# Altium schematic sheet kijek.SchDoc: 3D CANDLE - rączka
size A2; Address1: Jacek Martyniak; Address2: Łukasz Nowarkiewicz; DocumentNumber: 2017-01; Revision: 1.0; SheetNumber: 1; SheetTotal: 1; PageSetup: Record=PageOptionsŽCenterHorizontal=FalseŽCenterVertical=FalseŽPrintScale=0.62ŽXCorrection=1.00ŽYCorrection=1.00ŽPrintKind=0ŽBorderSize=5000000ŽLeftOffset=0ŽBottomOffset=0ŽOrientation=2ŽPaperLength=1000ŽPaperWidth=1000ŽScale=100ŽPaperSource=7ŽPrintQuality=-4ŽMediaType=1ŽDitherType=10ŽPaperKind=A4ŽPrintScaleMode=0
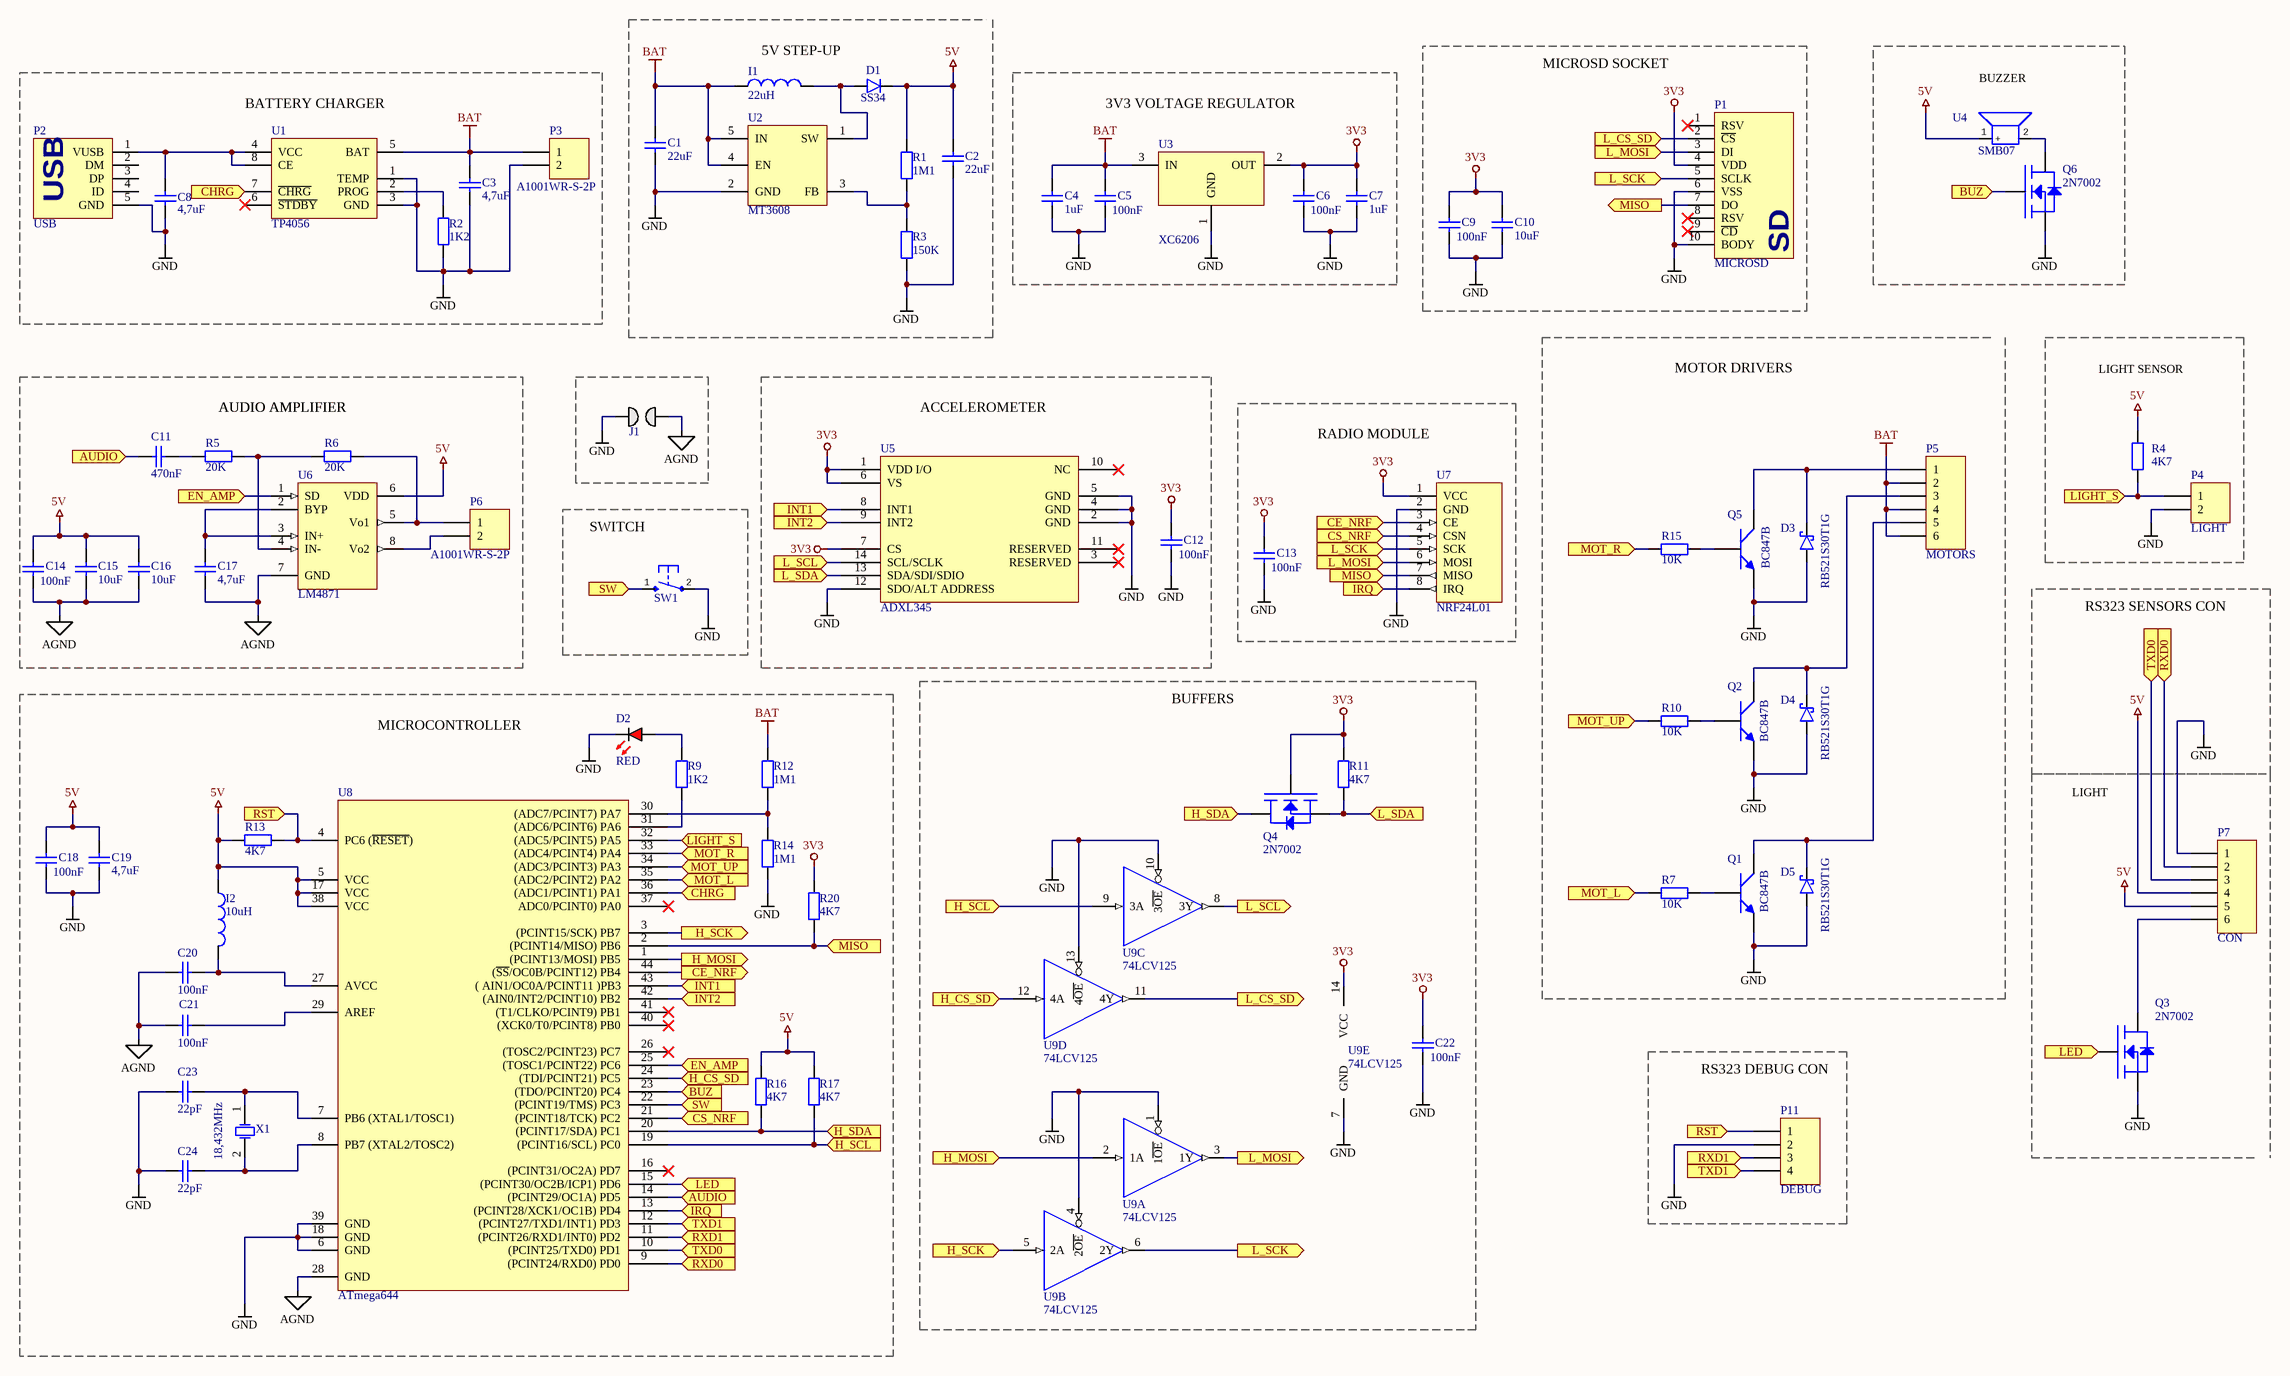
[diagram p0: kijek.SchDoc]

## Parts
C1  22uF  [C0603]
C2  22uF  [C0603]
C3  4,7uF  [C0603]
C4  1uF  [C0402]
C5  100nF  [C0402]
C6  100nF  [C0402]
C7  1uF  [C0402]
C8  4,7uF  [C0603]
C9  100nF  [C0402]
C10  10uF  [C0603]
C11  470nF  [C0402]
C12  100nF  [C0402]
C13  100nF  [C0402]
C14  100nF  [C0402]
C15  10uF  [C0603]
C16  10uF  [C0603]
C17  4,7uF  [C0603]
C18  100nF  [C0402]
C19  4,7uF  [C0603]
C20  100nF  [C0402]
C21  100nF  [C0402]
C22  100nF  [C0402]
C23  22pF  [C0402]
C24  22pF  [C0402]
D1  SS34  [SMA]
D2  RED  [LED0603]
D3  RB521S30T1G  [SOD523]
D4  RB521S30T1G  [SOD523]
D5  RB521S30T1G  [SOD523]
I1  22uH  [6x6x2.8mm]
I2  10uH  [I0603]
J1  SOLDER_JUMPER  [SOLDER_JUMPER]  (value not drawn)
P1  MICROSD  [MICROSD]
P2  USB  [MICRO_USB_2]
P3  A1001WR-S-2P  [A1001WR-S-2P]
P4  LIGHT  [A1001WR-S-2P]
P5  MOTORS  [A1001WR-S-6P]
P6  A1001WR-S-2P  [A1001WR-S-2P]
P7  CON  [MX-502352-0600]
P11  DEBUG  [PAD_4-1]
Q1  BC847B  [SOT23]
Q2  BC847B  [SOT23]
Q3  2N7002  [SOT23]
Q4  2N7002  [SOT23]
Q5  BC847B  [SOT23]
Q6  2N7002  [SOT23]
R1  1M1  [R0402]
R2  1K2  [R0402]
R3  150K  [R0402]
R4  4K7  [R0402]
R5  20K  [R0402]
R6  20K  [R0402]
R7  10K  [R0402]
R9  1K2  [R0402]
R10  10K  [R0402]
R11  4K7  [R0402]
R12  1M1  [R0402]
R13  4K7  [R0402]
R14  1M1  [R0402]
R15  10K  [R0402]
R16  4K7  [R0402]
R17  4K7  [R0402]
R20  4K7  [R0402]
SW1  SW_3x6x3.5mm  [3x6x3.5mm]  (value not drawn)
U1  TP4056  [SO-8]
U2  MT3608  [SOT-23-6]
U3  XC6206  [SOT23]
U4  SMB07  [SMB07]
U5  ADXL345  [LGA_CC-14]
U6  LM4871  [SO-8]
U7  NRF24L01  [NRF24L01]
U8  ATmega644  [TQFP-44A]
U9  74LCV125  [TSSOP-14]  (parts A,B,C,D,E of 5)
X1  18,432MHz  [CFPX-104]

## Blocks framed on the sheet
BATTERY CHARGER: C3 C8 P2 P3 R2 U1
3V3 VOLTAGE REGULATOR: C4-C7 U3
MICROSD SOCKET: C9 C10 P1
BUZZER: Q6 U4
ACCELEROMETER: C12 U5
LIGHT SENSOR: P4 R4
RADIO MODULE: C13 U7
SWITCH: SW1
MICROCONTROLLER: C18-C21 C23 C24 D2 I2 R9 R12-R14 R16 R17 R20 U8 X1
BUFFERS: C22 Q4 R11 U9
RS323 DEBUG CON: P11

## Ports
AUDIO, BUZ, CE_NRF, CE_NRF (out), CHRG, CS_NRF, EN_AMP, H_CS_SD, H_MOSI, H_MOSI (out), H_SCK, H_SCK (out), H_SCL, H_SDA, INT1, INT2, IRQ, L_CS_SD, L_CS_SD (out), L_MOSI, L_MOSI (out), L_SCK, L_SCK (out), L_SCL, L_SCL (out), L_SDA, LED, LIGHT_S, MISO, MISO (out), MOT_L, MOT_R, MOT_UP, RST, RXD0, RXD1, SW, TXD0, TXD1

## Nets
3V3: C6.1 C7.1 C9.1 C10.1 C12.1 C13.1 C22.1 P1.4(VDD) Q4.1(G) R11.1 R20.1 U3.2(OUT) U5.1(VDD_I/O) U5.6(VS) U5.7(CS) U7.1(VCC) U9.14(VCC)
5V: C2.1 C14.1 C15.1 C16.1 C18.1 C19.1 D1.1 I2.1 P7.4 P7.5 R1.1 R4.2 R13.1 R16.1 R17.1 U4.1(+) U6.6(VDD) U8.5(VCC) U8.17(VCC) U8.38(VCC)
AGND: C14.2 C15.2 C16.2 C17.2 C20.1 C21.2 J1.2 U6.7(GND) U8.28(GND)
BAT: C1.1 C3.1 C4.1 C5.1 I1.1 P3.1 P5.2 P5.4 P5.6 R12.2 U1.5(BAT) U2.4(EN) U2.5(IN) U3.3(IN)
GND: C1.2 C2.2 C3.2 C4.2 C5.2 C6.2 C7.2 C8.2 C9.2 C10.2 C12.2 C13.2 C18.2 C19.2 C22.2 C23.1 C24.2 D2.1 D3.2 D4.2 D5.2 J1.1 P1.6(VSS) P1.10(BODY) P2.5(GND) P3.2 P4.2 P7.1 P11.2 Q1.2(E) Q2.2(E) Q3.2(S) Q5.2(E) Q6.2(S) R2.1 R3.2 R14.2 SW1.2(P) U1.1(TEMP) U1.3(GND) U2.2(GND) U3.1(GND) U5.2(GND) U5.4(GND) U5.5(GND) U5.12(SDO/ALT_ADDRESS) U7.2(GND) U8.6(GND) U8.18(GND) U8.39(GND) U9.1(1~{OE}) U9.4(2~{OE}) U9.7(GND) U9.10(3~{OE}) U9.13(4~{OE})
AUDIO: C11.1 U8.14((PCINT29/OC1A)_PD5) ; port AUDIO
BUZ: Q6.1(G) U8.23((TDO/PCINT20)_PC4) ; port BUZ
CE_NRF: U7.3(CE) U8.44((~{SS}/OC0B/PCINT12)_PB4) ; port CE_NRF
CHRG: U1.7(~{CHRG}) U8.36((ADC1/PCINT1)_PA1) ; port CHRG
CS_NRF: U7.4(CSN) U8.21((PCINT18/TCK)_PC2) ; port CS_NRF
EN_AMP: U6.1(SD) U8.25((TOSC1/PCINT22)_PC6) ; port EN_AMP
H_CS_SD: U8.24((TDI/PCINT21)_PC5) U9.12(4A) ; port H_CS_SD
H_MOSI: U8.1((PCINT13/MOSI)_PB5) U9.2(1A) ; port H_MOSI
H_SCK: U8.3((PCINT15/SCK)_PB7) U9.5(2A) ; port H_SCK
H_SCL: R17.2 U8.19((PCINT16/SCL)_PC0) U9.9(3A) ; port H_SCL
H_SDA: Q4.3(D) R16.2 U8.20((PCINT17/SDA)_PC1) ; port H_SDA
INT1: U5.8(INT1) U8.43((_AIN1/OC0A/PCINT11_)PB3) ; port INT1
INT2: U5.9(INT2) U8.42((AIN0/INT2/PCINT10)_PB2) ; port INT2
IRQ: U7.8(IRQ) U8.13((PCINT28/XCK1/OC1B)_PD4) ; port IRQ
L_CS_SD: P1.2(~{CS}) U9.11(4Y) ; port L_CS_SD
L_MOSI: P1.3(DI) U7.6(MOSI) U9.3(1Y) ; port L_MOSI
L_SCK: P1.5(SCLK) U7.5(SCK) U9.6(2Y) ; port L_SCK
L_SCL: U5.14(SCL/SCLK) U9.8(3Y) ; port L_SCL
L_SDA: Q4.2(S) R11.2 U5.13(SDA/SDI/SDIO) ; port L_SDA
LED: Q3.1(G) U8.15((PCINT30/OC2B/ICP1)_PD6) ; port LED
LIGHT_S: P4.1 R4.1 U8.32((ADC5/PCINT5)_PA5) ; port LIGHT_S
MISO: P1.7(DO) R20.2 U7.7(MISO) U8.2((PCINT14/MISO)_PB6) ; port MISO
MOT_L: R7.2 U8.35((ADC2/PCINT2)_PA2) ; port MOT_L
MOT_R: R15.2 U8.33((ADC4/PCINT4)_PA4) ; port MOT_R
MOT_UP: R10.2 U8.34((ADC3/PCINT3)_PA3) ; port MOT_UP
RST: P11.1 R13.2 U8.4(PC6_(~{RESET})) ; port RST
RXD0: P7.2 U8.9((PCINT24/RXD0)_PD0) ; port RXD0
RXD1: P11.3 U8.11((PCINT26/RXD1/INT0)_PD2) ; port RXD1
SW: SW1.1(S) U8.22((PCINT19/TMS)_PC3) ; port SW
TXD0: P7.3 U8.10((PCINT25/TXD0)_PD1) ; port TXD0
TXD1: P11.4 U8.12((PCINT27/TXD1/INT1)_PD3) ; port TXD1
NetC8_1: C8.1 P2.1(VUSB) U1.4(VCC) U1.8(CE)
NetC11_2: C11.2 R5.1
NetC17_1: C17.1 U6.2(BYP) U6.3(IN+)
NetC20_2: C20.2 I2.2 U8.27(AVCC)
NetC21_1: C21.1 U8.29(AREF)
NetC23_2: C23.2 U8.7(PB6_(XTAL1/TOSC1)) X1.1(OSC1)
NetC24_1: C24.1 U8.8(PB7_(XTAL2/TOSC2)) X1.2(OSC2)
NetD1_2: D1.2 I1.2 U2.1(SW)
NetD2_2: D2.2 R9.1
NetD3_1: D3.1 P5.1 Q5.3(C)
NetD4_1: D4.1 P5.3 Q2.3(C)
NetD5_1: D5.1 P5.5 Q1.3(C)
NetP6_1: P6.1 R6.2 U6.5(Vo1)
NetP6_2: P6.2 U6.8(Vo2)
NetP7_6: P7.6 Q3.3(D)
NetQ1_1: Q1.1(B) R7.1
NetQ2_1: Q2.1(B) R10.1
NetQ5_1: Q5.1(B) R15.1
NetQ6_3: Q6.3(D) U4.2
NetR1_2: R1.2 R3.1 U2.3(FB)
NetR2_2: R2.2 U1.2(PROG)
NetR5_2: R5.2 R6.1 U6.4(IN-)
NetR9_2: R9.2 U8.31((ADC6/PCINT6)_PA6)
NetR12_1: R12.1 R14.1 U8.30((ADC7/PCINT7)_PA7)

Not connected (* = marked no-connect by the designer): P1 1(RSV)* 8(RSV)* 9(~{CD})*; P2 2(DM) 3(DP) 4(ID); U1 6(~{STDBY})*; U5 3(RESERVED)* 10(NC)* 11(RESERVED)*; U8 16((PCINT31/OC2A)_PD7)* 26((TOSC2/PCINT23)_PC7)* 37(ADC0/PCINT0)_PA0)* 40((XCK0/T0/PCINT8)_PB0)* 41((T1/CLKO/PCINT9)_PB1)*

## Notes on the sheet
- 5V STEP-UP
- MOTOR DRIVERS
- AUDIO AMPLIFIER
- RS323 SENSORS CON
- LIGHT
- Title
- Size:
- Date:
- File:
- A2
- Number:
- Time:
- Revision:
- Sheet
- of
- (in symbol MICROSD) SD

## Library data of the parts
C1-C24 = Cap: Capacitor
D1 = Diode
D2 = LED_RED: LED
D3-D5 = Diode Shottky
I1 I2 = Inductor
J1 = SOLDER_JUMPER: Header, 2-Pin
P2 = USB_2.0
P3 P4 P6 = A1001WR-S-2P: Header, 2-Pin
P5 P7 = Header 6: Header, 6-Pin
P11 = Header 4: Header, 4-Pin
Q1 Q2 Q5 = BC847C(BEC): NPN
Q3 Q4 Q6 = 2N7002(GSD): N-MOSFET
R1-R7 R9-R17 R20 = Res: Resistor
U4 = BUZ_SMB07
U8 = ATmega644: TQFP - 44pin / MLF - 44pin
U9 = 74LCV125: BUFFERS (3-STATE)
X1 = Crystal